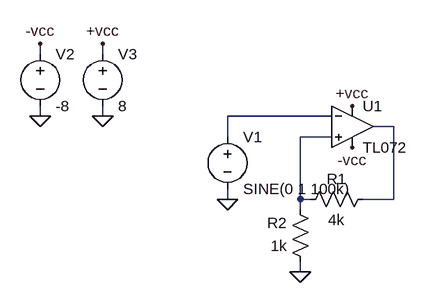
[diagram p0: schematic Draft4.asc]
Draft4.asc, the LTspice schematic file:
Version 4
SHEET 1 880 680
WIRE -160 0 -160 -16
WIRE -64 0 -64 -16
WIRE -160 96 -160 80
WIRE -64 96 -64 80
WIRE 288 96 128 96
WIRE 384 112 352 112
WIRE 128 128 128 96
WIRE 288 128 240 128
WIRE 128 224 128 208
WIRE 240 224 240 128
WIRE 256 224 240 224
WIRE 384 224 384 112
WIRE 384 224 336 224
WIRE 240 240 240 224
WIRE 240 336 240 320
FLAG 240 336 0
FLAG 128 224 0
FLAG -160 96 0
FLAG -64 96 0
FLAG -64 -16 +vcc
FLAG 320 80 +vcc
FLAG 320 144 -vcc
FLAG -160 -16 -vcc
SYMBOL voltage 128 112 R0
WINDOW 123 0 0 Left 0
WINDOW 39 0 0 Left 0
SYMATTR InstName V1
SYMATTR Value SINE(0 1 100k)
SYMBOL OpAmps\\TL072 320 48 R0
SYMATTR InstName U1
SYMBOL res 352 208 R90
WINDOW 0 0 56 VBottom 2
WINDOW 3 32 56 VTop 2
SYMATTR InstName R1
SYMATTR Value 4k
SYMBOL res 256 336 R180
WINDOW 0 36 76 Left 2
WINDOW 3 36 40 Left 2
SYMATTR InstName R2
SYMATTR Value 1k
SYMBOL voltage -160 -16 R0
WINDOW 123 0 0 Left 0
WINDOW 39 0 0 Left 0
SYMATTR InstName V2
SYMATTR Value -8
SYMBOL voltage -64 -16 R0
WINDOW 123 0 0 Left 0
WINDOW 39 0 0 Left 0
SYMATTR InstName V3
SYMATTR Value 8

The netlist it stands for:
* Draft4.asc
V1 N001 0 SINE(0 1 100k)
XU1 N003 N001 +vcc -vcc N002 TL072  ; pins In+ In- V+ V- OUT
R1 N002 N003 4k
R2 0 N003 1k
V2 -vcc 0 -8
V3 +vcc 0 8
.backanno
.end